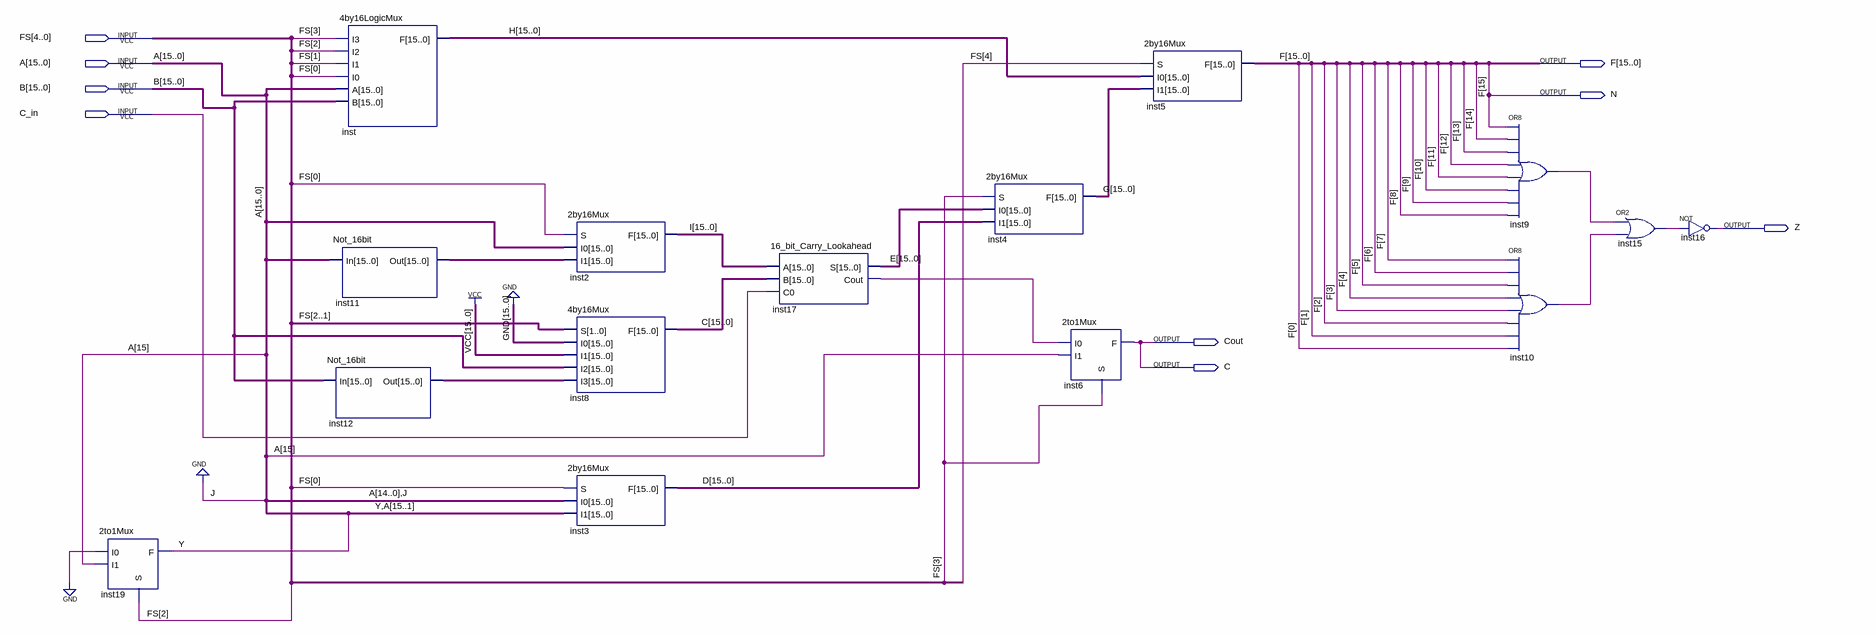
[diagram p0: schematic sheet]
// Quartus schematic ALU_Lookahead.bdf as structural Verilog: 15 symbols, 9 pins
module ALU_Lookahead (
  input  [4:0] FS,
  input  [15:0] A,
  input  [15:0] B,
  input  C_in,
  output [15:0] F,
  output N,
  output Z,
  output Cout,
  output C
);

  wire inst9_out, inst10_out, inst15_out, inst17_cout, Y;
  wire [15:0] C_bus, D, E, G, H, I, inst11_out, inst12_out;

  \2to1Mux  inst19 (.I0(1'b0), .I1(A[15]), .S(FS[2]), .F(Y));
  Not_16bit inst11 (.In(A), .Out(inst11_out));
  Not_16bit inst12 (.In(B), .Out(inst12_out));
  \4by16LogicMux  inst (.I3(FS[3]), .I2(FS[2]), .I1(FS[1]), .I0(FS[0]), .A(A), .B(B), .F(H));
  \2by16Mux  inst2 (.S(FS[0]), .I0(A), .I1(inst11_out), .F(I));
  \4by16Mux  inst8 (.S(FS[2:1]), .I0({16{1'b0}}), .I1({16{1'b1}}), .I2(B), .I3(inst12_out), .F(C_bus));
  \2by16Mux  inst3 (.S(FS[0]), .I0({A[14:0], 1'b0}), .I1({Y, A[15:1]}), .F(D));
  \16_bit_Carry_Lookahead  inst17 (.A(I), .B(C_bus), .C0(C_in), .Cout(inst17_cout), .S(E));
  \2by16Mux  inst4 (.S(FS[3]), .I0(E), .I1(D), .F(G));
  \2to1Mux  inst6 (.I0(inst17_cout), .I1(A[15]), .S(FS[3]), .F(C));
  \2by16Mux  inst5 (.S(FS[4]), .I0(H), .I1(G), .F(F));
  or inst9 (inst9_out, F[15], F[14], F[13], F[12], F[11], F[10], F[9], F[8]);
  or inst10 (inst10_out, F[7], F[6], F[5], F[4], F[3], F[2], F[1], F[0]);
  or inst15 (inst15_out, inst9_out, inst10_out);
  not inst16 (Z, inst15_out);

  assign Cout = C;
  assign N = F[15];
endmodule
